# EAGLE design bbbcape (EAGLE 7.7.0)
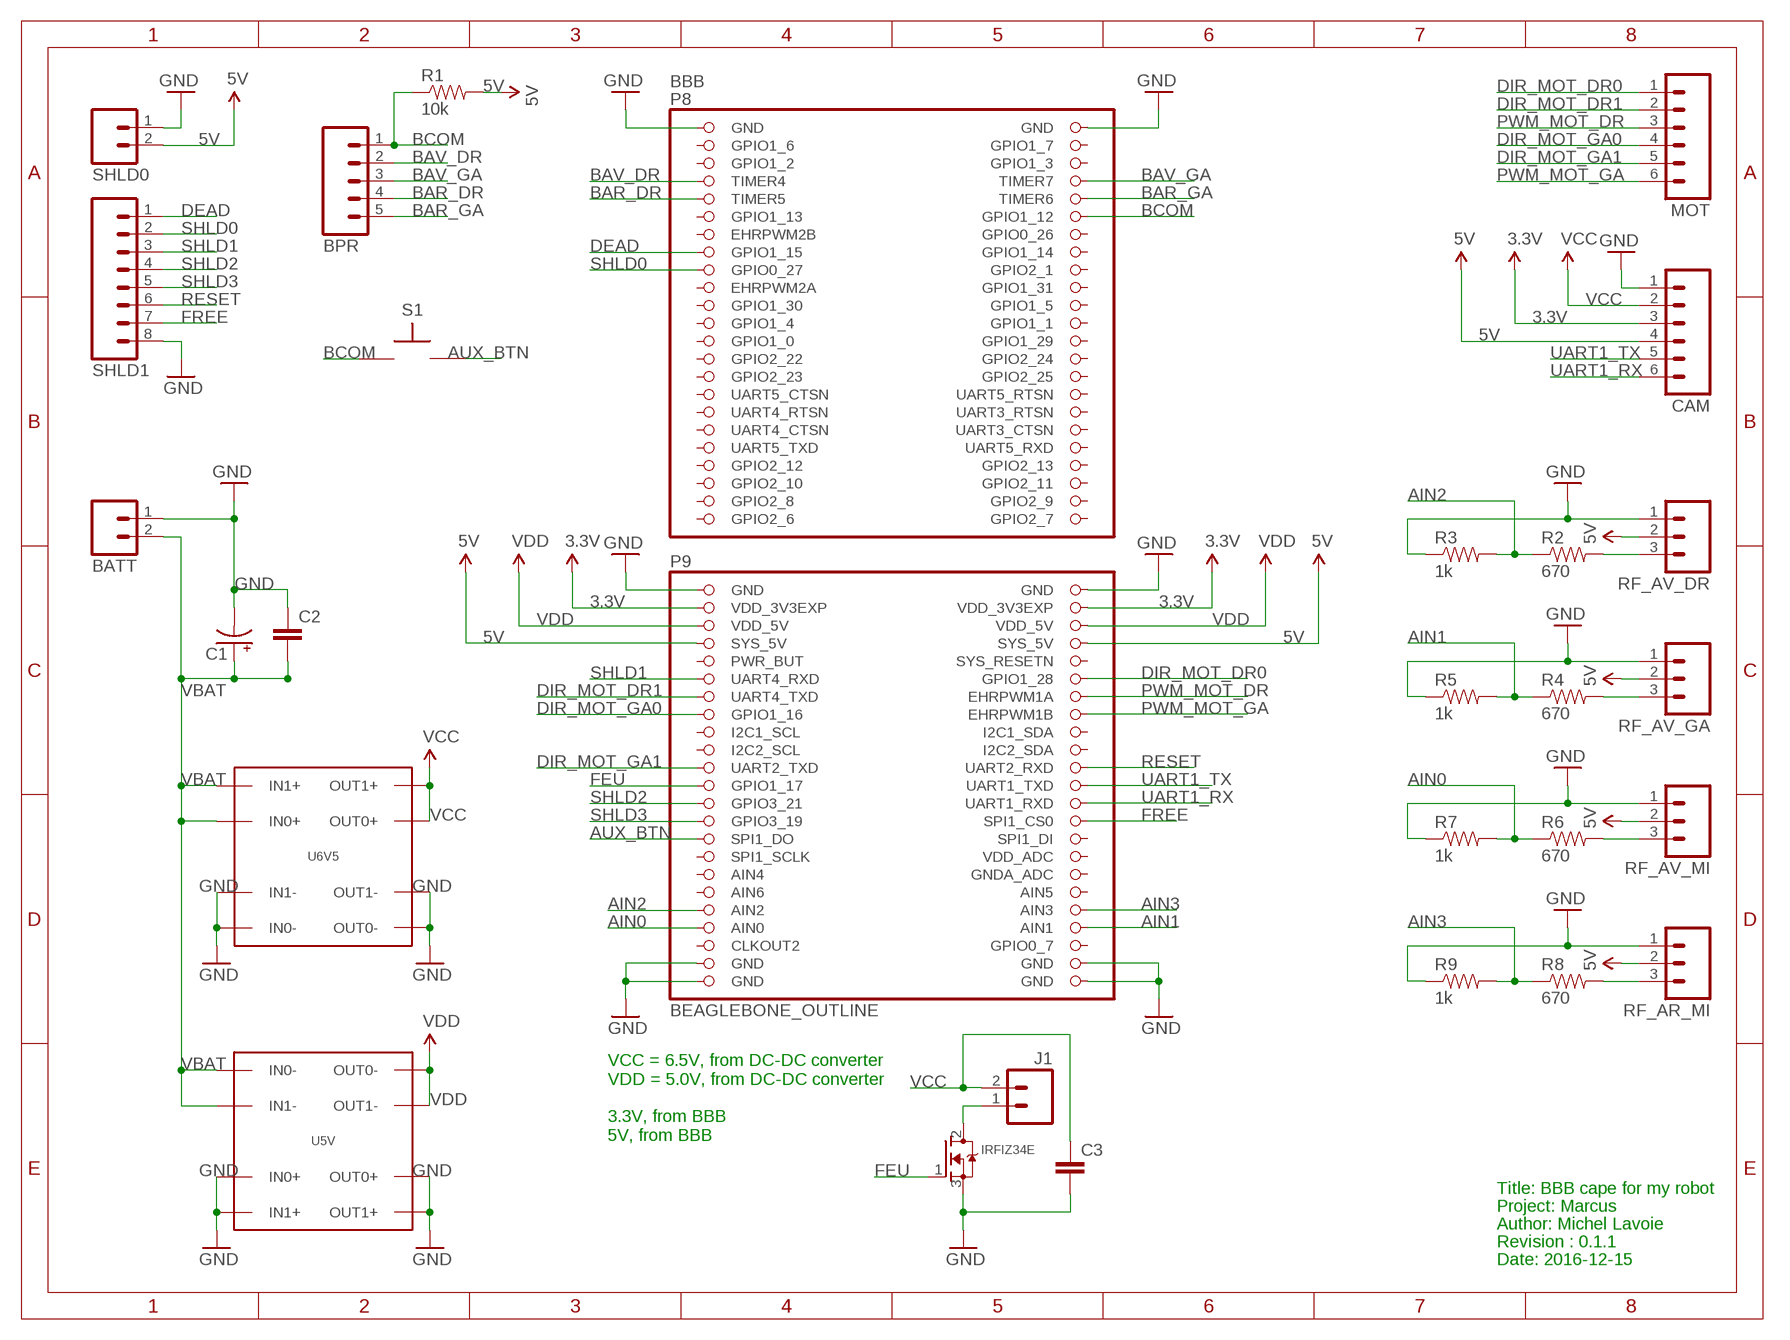
[diagram p0: schematic, sheet 1]

## Parts
BATT  M02PTH  [1X02]
BBB  BEAGLEBONE_OUTLINE  [BEAGLEBONE_SHIELD]
BPR  M05PTH  [1X05]
C1  100UF-25V-20%(PTH)  [CPOL-RADIAL-100UF-25V]
C2  0.1UF-50V-20%(PTH)KIT-EZ  [CAP-PTH-SMALL-KIT]
C3  0.1UF-50V-20%(PTH)KIT-EZ  [CAP-PTH-SMALL-KIT]
CAM  M06SILK_FEMALE_PTH  [1X06]
IRFIZ34E  MOSFET-NGDS_TO220V  [TO220V]
J1  M02PTH  [1X02]
MOT  M06SILK_FEMALE_PTH  [1X06]
R1  10k  RESISTORAXIAL-0.3  [AXIAL-0.3]
R2  670  RESISTORAXIAL-0.3  [AXIAL-0.3]
R3  1k  RESISTORAXIAL-0.3  [AXIAL-0.3]
R4  670  RESISTORAXIAL-0.3  [AXIAL-0.3]
R5  1k  RESISTORAXIAL-0.3  [AXIAL-0.3]
R6  670  RESISTORAXIAL-0.3  [AXIAL-0.3]
R7  1k  RESISTORAXIAL-0.3  [AXIAL-0.3]
R8  670  RESISTORAXIAL-0.3  [AXIAL-0.3]
R9  1k  RESISTORAXIAL-0.3  [AXIAL-0.3]
RF_AR_MI  M03PTH  [1X03]
RF_AV_DR  M03PTH  [1X03]
RF_AV_GA  M03PTH  [1X03]
RF_AV_MI  M03PTH  [1X03]
S1  TACTILE-SPST-6MM-SLIM  [6MM-SLIM]
SHLD0  M02PTH  [1X02]
SHLD1  M08  [1X08_ROUND]
U5V  SEEED-MP1584  [SEEED-MP1584]
U6V5  SEEED-MP1584  [SEEED-MP1584]

## Nets
3.3V: BBB.49(VDD_3V3EXP) BBB.50(VDD_3V3EXP) CAM.3
5V: BBB.53(SYS_5V) BBB.54(SYS_5V) CAM.4 R1.P$2 RF_AR_MI.2 RF_AV_DR.2 RF_AV_GA.2 RF_AV_MI.2 SHLD0.2
AIN0: BBB.85(AIN0) R6.P$1 R7.P$2
AIN1: BBB.86(AIN1) R4.P$1 R5.P$2
AIN2: BBB.83(AIN2) R2.P$1 R3.P$2
AIN3: BBB.84(AIN3) R8.P$1 R9.P$2
AUX_BTN: BBB.75(SPI1_DO) S1.P$2
BAR_DR: BBB.9(TIMER5) BPR.4
BAR_GA: BBB.10(TIMER6) BPR.5
BAV_DR: BBB.7(TIMER4) BPR.2
BAV_GA: BBB.8(TIMER7) BPR.3
BCOM: BBB.12(GPIO1_12) BPR.1 R1.P$1 S1.P$1
DEAD: BBB.15(GPIO1_15) SHLD1.1
DIR_MOT_DR0: BBB.58(GPIO1_28) MOT.1
DIR_MOT_DR1: BBB.59(UART4_TXD) MOT.2
DIR_MOT_GA0: BBB.61(GPIO1_16) MOT.4
DIR_MOT_GA1: BBB.67(UART2_TXD) MOT.5
FEU: BBB.69(GPIO1_17) IRFIZ34E.1(G)
FREE: BBB.74(SPI1_CS0) SHLD1.7
GND: BATT.1 BBB.1(GND) BBB.2(GND) BBB.47(GND) BBB.48(GND) BBB.89(GND) BBB.90(GND) BBB.91(GND) BBB.92(GND) C1.2(-) C2.1 C3.2 CAM.1 IRFIZ34E.3(S) R3.P$1 R5.P$1 R7.P$1 R9.P$1 RF_AR_MI.1 RF_AV_DR.1 RF_AV_GA.1 RF_AV_MI.1 SHLD0.1 SHLD1.8 U5V.IN0+ U5V.IN1+ U5V.OUT0+ U5V.OUT1+ U6V5.IN0- U6V5.IN1- U6V5.OUT0- U6V5.OUT1-
N$1: R2.P$2 RF_AV_DR.3
N$2: R4.P$2 RF_AV_GA.3
N$3: IRFIZ34E.2(D) J1.1
N$4: R6.P$2 RF_AV_MI.3
N$5: R8.P$2 RF_AR_MI.3
PWM_MOT_DR: BBB.60(EHRPWM1A) MOT.3
PWM_MOT_GA: BBB.62(EHRPWM1B) MOT.6
RESET: BBB.68(UART2_RXD) SHLD1.6
SHLD0: BBB.17(GPIO0_27) SHLD1.2
SHLD1: BBB.57(UART4_RXD) SHLD1.3
SHLD2: BBB.71(GPIO3_21) SHLD1.4
SHLD3: BBB.73(GPIO3_19) SHLD1.5
UART1_RX: BBB.72(UART1_RXD) CAM.6
UART1_TX: BBB.70(UART1_TXD) CAM.5
VBAT: BATT.2 C1.1(+) C2.2 U5V.IN0- U5V.IN1- U6V5.IN0+ U6V5.IN1+
VCC: C3.1 CAM.2 J1.2 U6V5.OUT0+ U6V5.OUT1+
VDD: BBB.51(VDD_5V) BBB.52(VDD_5V) U5V.OUT0- U5V.OUT1-
Unconnected: BBB.3(GPIO1_6) BBB.4(GPIO1_7) BBB.5(GPIO1_2) BBB.6(GPIO1_3) BBB.11(GPIO1_13) BBB.13(EHRPWM2B) BBB.14(GPIO0_26) BBB.16(GPIO1_14) BBB.18(GPIO2_1) BBB.19(EHRPWM2A) BBB.20(GPIO1_31) BBB.21(GPIO1_30) BBB.22(GPIO1_5) BBB.23(GPIO1_4) BBB.24(GPIO1_1) BBB.25(GPIO1_0) BBB.26(GPIO1_29) BBB.27(GPIO2_22) BBB.28(GPIO2_24) BBB.29(GPIO2_23) BBB.30(GPIO2_25) BBB.31(UART5_CTSN) BBB.32(UART5_RTSN) BBB.33(UART4_RTSN) BBB.34(UART3_RTSN) BBB.35(UART4_CTSN) BBB.36(UART3_CTSN) BBB.37(UART5_TXD) BBB.38(UART5_RXD) BBB.39(GPIO2_12) BBB.40(GPIO2_13) BBB.41(GPIO2_10) BBB.42(GPIO2_11) BBB.43(GPIO2_8) BBB.44(GPIO2_9) BBB.45(GPIO2_6) BBB.46(GPIO2_7) BBB.55(PWR_BUT) BBB.56(SYS_RESETN) BBB.63(I2C1_SCL) BBB.64(I2C1_SDA) BBB.65(I2C2_SCL) BBB.66(I2C2_SDA) BBB.76(SPI1_DI) BBB.77(SPI1_SCLK) BBB.78(VDD_ADC) BBB.79(AIN4) BBB.80(GNDA_ADC) BBB.81(AIN6) BBB.82(AIN5) BBB.87(CLKOUT2) BBB.88(GPIO0_7)

## Notes on the sheet
- VCC = 6.5V, from DC-DC converter
  VDD = 5.0V, from DC-DC converter
  
  3.3V, from BBB
  5V, from BBB
- Title: BBB cape for my robot
- Project: Marcus
- Author: Michel Lavoie
- Revision : 0.1.1
- Date: 2016-12-15

## Library data of the parts
BATT J1 SHLD0 = SparkFun-Connectors:M02: Standard 2-pin 0.1" header. Use with - straight break away headers ( PRT-00116) - right angle break away headers (PRT-00553) - swiss pins (PRT-00743) - machine pins (PRT-00117) - female headers (PRT-00115) Molex polarized connector foot print use with: PRT-08233 with associated crimp pins and housings. 2.54_SCREWTERM for use with PRT-10571. 3.5mm Screw Terminal footprints for PRT-08084 5mm Screw Terminal footprints for use with PRT-08432
BBB = adafruit:BEAGLEBONE_OUTLINE: Should match A3 pinout - but not completely tested
BPR = SparkFun-Connectors:M05: Header 5 Standard 5-pin 0.1" header. Use with straight break away headers (SKU : PRT-00116), right angle break away headers (PRT-00553), swiss pins (PRT-00743), machine pins (PRT-00117), and female headers (PRT-00115). Molex polarized connector foot print use with SKU : PRT-08230 with associated crimp pins and housings.
C1 = SparkFun-Capacitors:100UF-25V-20%(PTH): CAP-08439; PROD_ID: CAP-08439
C2 C3 = SparkFun-Capacitors:0.1UF-50V-20%(PTH): CAP-08370; PROD_ID: CAP-08370
CAM MOT = SparkFun-Connectors:M06: Header 6 Standard 6-pin 0.1" header. Use with straight break away headers (SKU : PRT-00116), right angle break away headers (PRT-00553), swiss pins (PRT-00743), machine pins (PRT-00117), and female headers (PRT-00115). Molex polarized connector foot print use with SKU : PRT-08094 with associated crimp pins and housings. NOTES ON THE VARIANTS LOCK and LOCK_LONGPADS... This footprint was designed to help hold the alignment of a through-hole component (i.e. 6-pin header) while soldering it into place. You may notice that each hole has been shifted either up or down by 0.005 of an inch from it's more standard position (which is a perfectly straight line). This slight alteration caused the pins (the squares in the middle) to touch the edges of the holes. Because they are alternating, it causes a "brace" to hold the component in place. 0.005 has proven to be the perfect amount of "off-center" position when using our standard breakaway headers. Although looks a little odd when you look at the bare footprint, once you have a header in there, the alteration is very hard to notice. Also,if you push a header all the way into place, it is covered up entirely on the bottom side. This idea of altering the position of holes to aid alignment will be further integrated into the Sparkfun Library for other footprints. It can help hold any component with 3 or more connection pins.; PROD_ID: CONN-08437
IRFIZ34E = adafruit:MOSFET-N: N-Channel Mosfet 2N7002E - 60V 260mA SOT23 [Digikey: 2N7002ET1GOSTR-ND] - REEL BSH103 - 30V 850mA SOT23 [Digikey: 568-5013-1-ND]
R1-R9 = SparkFun-Passives:RESISTOR: Resistor Basic schematic elements and footprints for 0603, 1206, and PTH resistors.
RF_AR_MI RF_AV_DR RF_AV_GA RF_AV_MI = SparkFun-Connectors:M03: Header 3 Standard 3-pin 0.1" header. Use with straight break away headers (SKU : PRT-00116), right angle break away headers (PRT-00553), swiss pins (PRT-00743), machine pins (PRT-00117), and female headers (PRT-00115). Molex polarized connector foot print use with SKU : PRT-08232 with associated crimp pins and housings.
S1 = michel:TACTILE-SPST-6MM-SLIM: Tactile Switch Buttons (6mm slim) https://www.adafruit.com/product/1489
SHLD1 = SparkFun-Connectors:M08: Header 8 Standard 8-pin 0.1" header. Use with straight break away headers (SKU : PRT-00116), right angle break away headers (PRT-00553), swiss pins (PRT-00743), machine pins (PRT-00117), and female headers (PRT-00115).; PROD_ID: CONN-08437
U5V U6V5 = michel:SEEED-MP1584: Adjustable Step-Down DC&DC Converter (0.8V - 18V&3A) SKU 106990005 https://www.seeedstudio.com/Adjustable-Step-Down-DC%26amp%3BDC-Converter-(0.8V-18V%26amp%3B3A)-p-1716.html#

## Board
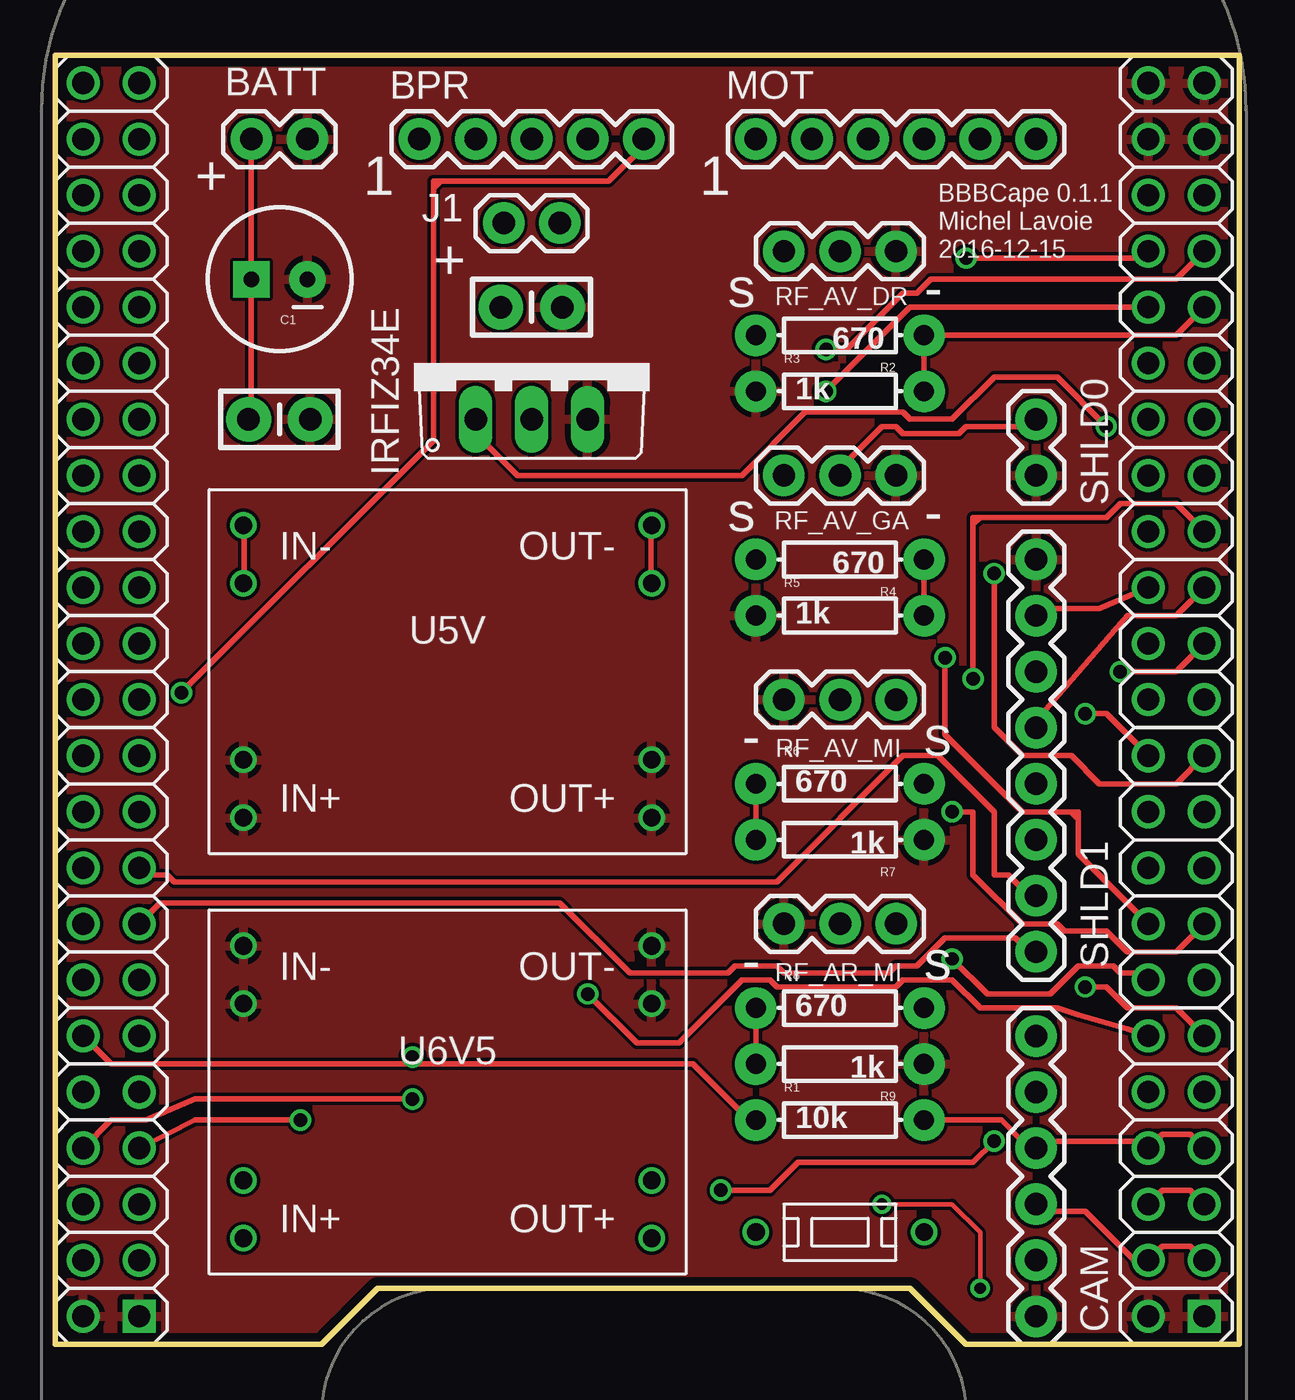
[diagram p1: board, top side]
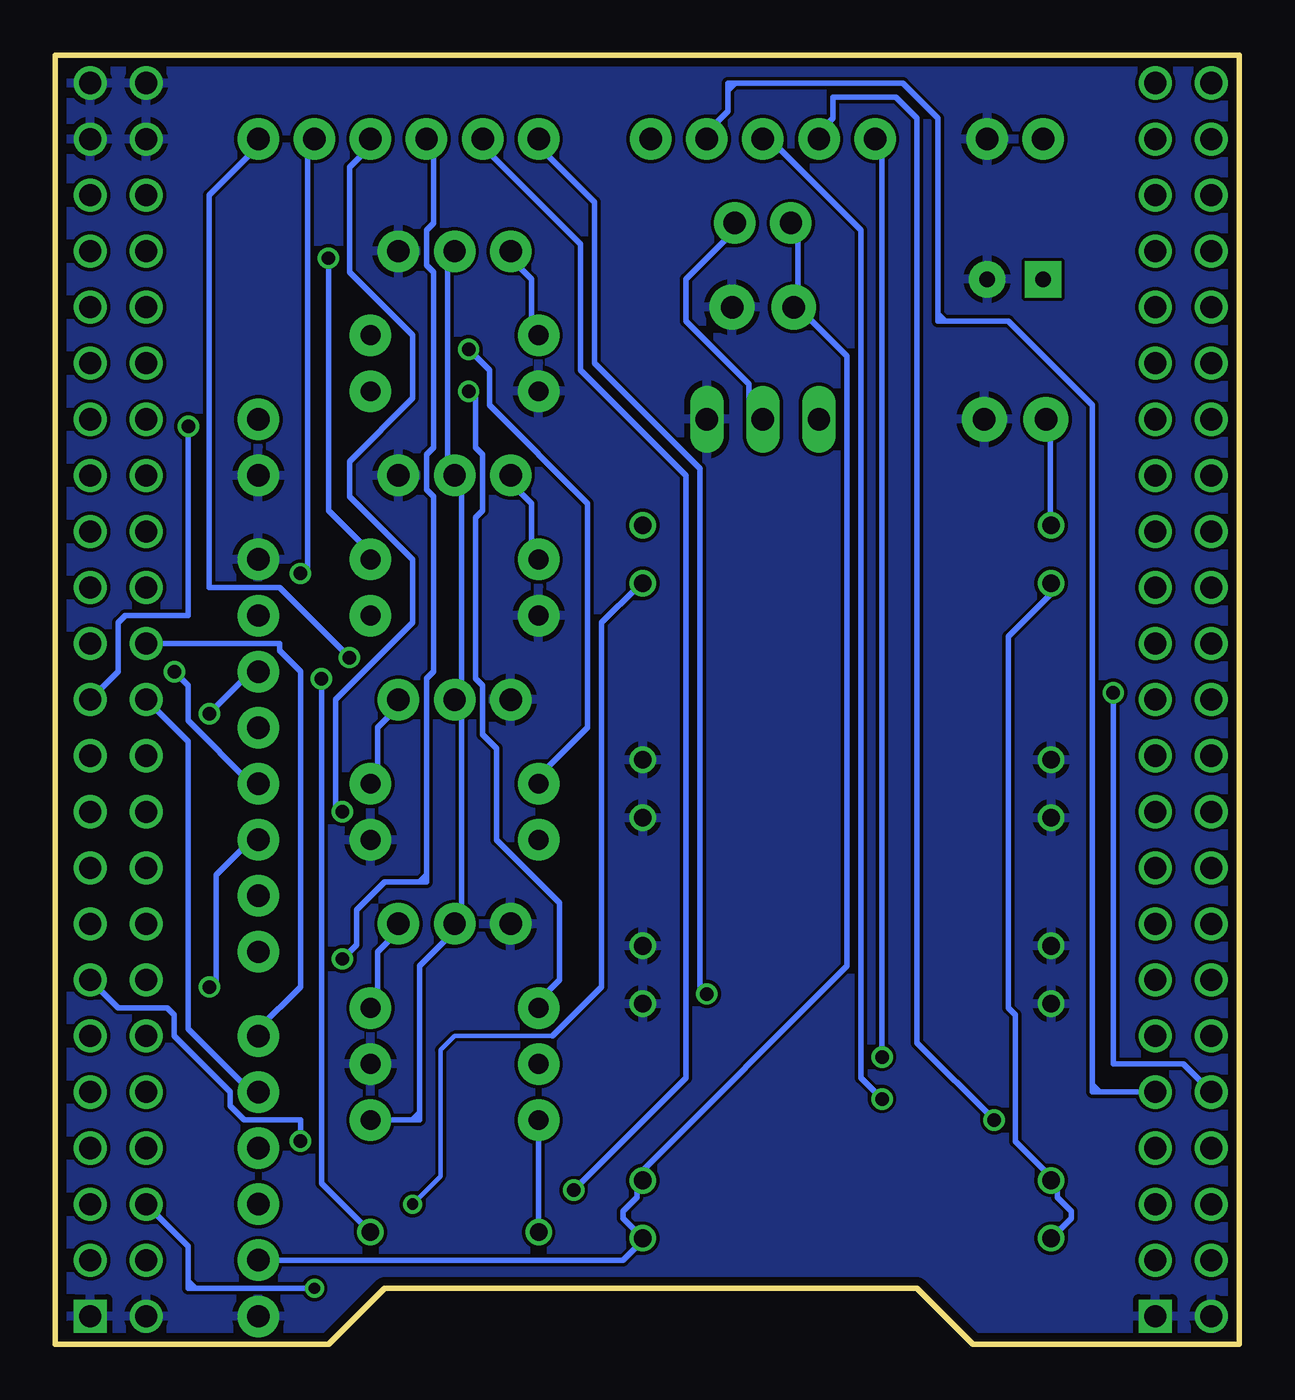
[diagram p2: board, bottom side, seen from below]

Size 53.66 x 58.41 mm. Coordinates in mm from the lower left corner, seen from the top.
Outline: 53.65,0 53.65,58.41 0,58.41 0,0 12.06,0 14.61,2.54 38.73,2.54 41.27,0 53.66,0
Copper layers (1*16): Top 0.0356mm / dielectric 1.5011mm / Bottom 0.0356mm
Design rules "oshpark-2layer": minimum track width 6mil, minimum drill 13mil, track to track 6mil, track to pad 6mil, pad to pad 6mil, via to via 6mil, smd to smd 6mil, copper to edge 15mil, drill to drill 6mil, minimum pad ring 7mil, minimum via ring 7mil, stop-mask expansion 2.5mil, vias tented up to drill 0mil, thermal gap 10mil

### Footprints (pad centres in the part's own frame; a part is rotated, then mirrored left to right if it is on the bottom)
1X02 = drill 1.016 pad 1.88: 1 0,0; 2 2.54,0
BEAGLEBONE_SHIELD = drill 1 square: 1 4.445,19.05; 47 52.705,19.05 | drill 1: 2 1.905,19.05; 3 4.445,21.59; 4 1.905,21.59; 5 4.445,24.13; 6 1.905,24.13; 7 4.445,26.67; 8 1.905,26.67; 9 4.445,29.21; 10 1.905,29.21; 11 4.445,31.75; 12 1.905,31.75; 13 4.445,34.29; 14 1.905,34.29; 15 4.445,36.83; 16 1.905,36.83; 17 4.445,39.37; 18 1.905,39.37; 19 4.445,41.91; 20 1.905,41.91; 21 4.445,44.45; 22 1.905,44.45; 23 4.445,46.99; 24 1.905,46.99; 25 4.445,49.53; 26 1.905,49.53; 27 4.445,52.07; 28 1.905,52.07; 29 4.445,54.61; 30 1.905,54.61; 31 4.445,57.15; 32 1.905,57.15; 33 4.445,59.69; 34 1.905,59.69; 35 4.445,62.23; 36 1.905,62.23; 37 4.445,64.77; 38 1.905,64.77; 39 4.445,67.31; 40 1.905,67.31; 41 4.445,69.85; 42 1.905,69.85; 43 4.445,72.39; 44 1.905,72.39; 45 4.445,74.93; 46 1.905,74.93; 48 50.165,19.05; 49 52.705,21.59; 50 50.165,21.59; 51 52.705,24.13; 52 50.165,24.13; 53 52.705,26.67; 54 50.165,26.67; 55 52.705,29.21; 56 50.165,29.21; 57 52.705,31.75; 58 50.165,31.75; 59 52.705,34.29; 60 50.165,34.29; 61 52.705,36.83; 62 50.165,36.83; 63 52.705,39.37; 64 50.165,39.37; 65 52.705,41.91; 66 50.165,41.91; 67 52.705,44.45; 68 50.165,44.45; 69 52.705,46.99; 70 50.165,46.99; 71 52.705,49.53; 72 50.165,49.53; 73 52.705,52.07; 74 50.165,52.07; 75 52.705,54.61; 76 50.165,54.61; 77 52.705,57.15; 78 50.165,57.15; 79 52.705,59.69; 80 50.165,59.69; 81 52.705,62.23; 82 50.165,62.23; 83 52.705,64.77; 84 50.165,64.77; 85 52.705,67.31; 86 50.165,67.31; 87 52.705,69.85; 88 50.165,69.85; 89 52.705,72.39; 90 50.165,72.39; 91 52.705,74.93; 92 50.165,74.93
1X05 = drill 1.016 pad 1.88: 1 0,0; 2 2.54,0; 3 5.08,0; 4 7.62,0; 5 10.16,0
CPOL-RADIAL-100UF-25V = drill 0.7 pad 1.651 square: 1 1.27,0 | drill 0.7 pad 1.651: 2 -1.27,0
CAP-PTH-SMALL-KIT = drill 1.016 pad 2.032: 1 -1.397,0; 2 1.397,0
1X06 = drill 1.016 pad 1.88: 1 0,0; 2 2.54,0; 3 5.08,0; 4 7.62,0; 5 10.16,0; 6 12.7,0
TO220V = drill 1.016 long: 1 -2.54,-2.54; 2 0,-2.54; 3 2.54,-2.54
AXIAL-0.3 = drill 0.9 pad 1.88: P$1 -3.81,0; P$2 3.81,0
1X03 = drill 1.016 pad 1.88: 1 0,0; 2 2.54,0; 3 5.08,0
6MM-SLIM = drill 0.8: P$1 -3.81,0; P$2 3.81,0
1X08_ROUND = drill 1.016 pad 1.88: 1 0,0; 2 2.54,0; 3 5.08,0; 4 7.62,0; 5 10.16,0; 6 12.7,0; 7 15.24,0; 8 17.78,0
SEEED-MP1584 = drill 0.8: IN0+ -9.25,-4; IN0- -9.25,6.625; IN1+ -9.25,-6.625; IN1- -9.25,4; OUT0+ 9.25,-4; OUT0- 9.25,6.625; OUT1+ 9.25,-6.625; OUT1- 9.25,4

### Placement (x,y rotation side)
BATT  11.43,54.61 180 top
BBB  -0.64,-17.78 0 top
BPR  16.51,54.61 0 top
C1  10.16,48.26 180 top
C2  10.16,41.91 180 top
C3  21.59,46.99 0 top
CAM  44.45,1.27 90 top
IRFIZ34E  21.59,44.45 0 top
J1  22.86,50.8 180 top
MOT  31.75,54.61 0 top
R1  35.56,10.16 0 top
R2  35.56,45.72 180 top
R3  35.56,43.18 0 top
R4  35.56,35.56 180 top
R5  35.56,33.02 0 top
R6  35.56,25.4 0 top
R7  35.56,22.86 180 top
R8  35.56,15.24 0 top
R9  35.56,12.7 180 top
RF_AR_MI  33.02,19.05 0 top
RF_AV_DR  38.1,49.53 180 top
RF_AV_GA  38.1,39.37 180 top
RF_AV_MI  33.02,29.21 0 top
S1  35.56,5.08 0 top
SHLD0  44.45,39.37 90 top
SHLD1  44.45,17.78 90 top
U5V  17.78,30.48 0 top
U6V5  17.78,11.43 0 top

### Tracks (layer width: path | path; a pad name or v marks a point on that pad's centre or on a via)
3.3V
  Top 0.254: BBB.49 51.44,4.45 50.16,4.45 BBB.50 48.9,3.81 46.67,6.03 44.77,6.03 CAM.3
5V
  Top 0.254: BBB.53 51.44,9.53 50.16,9.53 BBB.54 49.21,9.21 43.81,9.21 | R1.P$2 42.86,10.16 43.81,9.21 | 43.81,9.21 44.13,8.89 CAM.4 43.81,9.21 | SHLD0.2 44.13,41.59 41.27,41.59 40.96,41.27 38.42,41.27 38.1,41.59 37.47,41.59 35.56,39.69 RF_AV_GA.2
  Bottom 0.254: 35.24,28.89 35.24,19.37 RF_AR_MI.2 35.56,18.73 37.15,17.14 37.15,10.48 | 35.24,28.89 35.24,39.05 RF_AV_GA.2 35.88,39.69 35.88,49.21 RF_AV_DR.2 | 35.24,28.89 RF_AV_MI.2 | 37.47,10.16 37.15,10.16 37.15,10.48 | 37.47,10.16 R1.P$2 | 37.15,10.48 37.47,10.16
AIN0  (via drill 0.61)
  Top 0.254: BBB.85 50.8,48.26 39.69,48.26 39.05,47.62 38.42,47.62 35.88,45.09 v34.92,45.09 | R6.P$1 R7.P$2
  Bottom 0.254: v34.92,45.09 33.97,44.13 33.97,42.55 29.53,38.1 29.53,27.94 31.75,25.72 R6.P$1
AIN1  (via drill 0.61)
  Top 0.254: BBB.86 49.21,49.21 v41.27,49.21 | R4.P$1 R5.P$2
  Bottom 0.254: v41.27,49.21 41.27,37.78 39.37,35.88 R4.P$1
AIN2
  Top 0.254: BBB.83 50.8,45.72 R2.P$1 R3.P$2
AIN3  (via drill 0.61)
  Top 0.254: BBB.84 38.73,46.99 v34.92,43.18 | R8.P$1 R9.P$2
  Bottom 0.254: v34.92,43.18 34.61,42.86 34.61,40.64 34.29,40.32 34.29,37.78 34.61,37.47 34.61,30.16 34.29,29.84 34.29,27.62 33.66,26.99 33.66,22.86 30.8,20 30.8,16.51 31.75,15.56 R8.P$1
AUX_BTN  (via drill 0.61)
  Top 0.254: 41.59,37.15 41.59,37.47 41.91,37.47 | 41.59,37.15 v41.59,30.16 | 41.91,37.47 47.62,37.47 48.26,38.1 50.8,38.1 BBB.75 | 41.91,37.47 41.59,37.15
  Bottom 0.254: S1.P$2 41.59,7.3 v41.59,30.16
BAR_DR
  Bottom 0.254: 6.35,11.43 6.67,11.43 6.67,11.75 | 6.35,11.43 BBB.9 | 6.67,11.75 6.67,42.55 10.48,46.35 13.34,46.35 | 13.34,46.35 13.65,46.35 13.65,46.67 | 13.65,46.67 13.65,55.56 15.24,57.15 22.86,57.15 | 22.86,57.15 23.18,57.15 23.18,56.83 | 23.18,56.83 23.18,55.88 24.13,54.93 BPR.4 | 22.86,57.15 23.18,56.83 | 13.34,46.35 13.65,46.67 | 6.35,11.43 6.67,11.75
BAR_GA  (via drill 0.61)
  Top 0.254: v5.71,29.53 17.14,40.96 17.14,52.39 | 17.14,52.39 17.14,52.7 17.46,52.7 | 17.46,52.7 25.08,52.7 26.67,54.29 BPR.5 | 17.14,52.39 17.46,52.7
  Bottom 0.254: BBB.10 2.54,12.7 5.71,12.7 v5.71,29.53
BAV_DR  (via drill 0.61)
  Top 0.254: BBB.7 6.35,10.16 v11.11,10.16
  Bottom 0.254: v11.11,10.16 14.61,13.65 14.61,55.56 15.56,56.52 18.41,56.52 18.41,55.56 19.05,54.93 BPR.2
BAV_GA  (via drill 0.61)
  Top 0.254: BBB.8 2.54,10.16 4.13,10.16 6.35,11.11 v16.19,11.11
  Bottom 0.254: v16.19,11.11 17.14,12.06 17.14,50.48 21.27,54.61 BPR.3
BCOM  (via drill 0.61)
  Top 0.254: BBB.12 2.54,12.7 16.19,12.7 | 16.19,12.7 28.89,12.7 31.43,10.16 R1.P$1 | 16.19,12.7 v16.19,13.02
  Bottom 0.254: R1.P$1 S1.P$1 | BPR.1 16.19,54.29 v16.19,13.02
DEAD
  Top 0.254: BBB.15 4.76,20 22.86,20 26.04,16.83 30.48,16.83 30.8,17.14 32.7,17.14 33.02,16.83 37.78,16.83 38.1,17.14 39.05,17.14 40.32,18.41 43.5,18.41 44.13,17.78 SHLD1.1
DIR_MOT_DR0  (via drill 0.61)
  Top 0.254: BBB.58 48.58,14.29 46.35,14.92 45.4,15.24 41.91,15.24 40.64,16.51 38.42,16.51 38.1,16.19 32.7,16.19 32.38,16.51 31.11,16.51 28.26,13.65 26.35,13.65 v24.13,15.88
  Bottom 0.254: v24.13,15.88 24.45,16.19 24.45,39.69 29.21,44.45 29.21,51.75 31.75,54.29 MOT.1
DIR_MOT_DR1  (via drill 0.61)
  Top 0.254: v42.55,9.21 41.59,8.26 33.66,8.26 32.38,6.99 v30.16,6.99
  Bottom 0.254: BBB.59 50.8,15.24 48.58,15.24 48.26,14.92 48.26,13.97 45.72,11.43 45.72,10.79 45.09,10.16 42.55,10.16 v42.55,9.21 | MOT.2 34.29,54.29 29.84,49.85 29.84,44.13 25.08,39.37 25.08,12.06 v30.16,6.99
DIR_MOT_GA0  (via drill 0.61)
  Top 0.254: BBB.61 50.8,17.78 48.58,17.78 47.62,18.73 45.72,18.73 45.4,19.05 43.81,19.05 41.59,21.27 41.59,24.13 v40.64,24.13
  Bottom 0.254: v40.64,24.13 40.96,24.45 40.96,29.21 37.47,32.7 37.47,35.56 40.32,38.42 40.32,40.01 37.47,42.86 37.47,45.72 40.32,48.58 40.32,53.34 39.37,54.29 MOT.4
DIR_MOT_GA1  (via drill 0.61)
  Top 0.254: BBB.67 50.8,25.4 47.31,25.4 46.04,26.67 43.81,26.67 42.55,27.94 v42.55,34.92
  Bottom 0.254: v42.55,34.92 42.23,35.24 42.23,54.29 MOT.5
FEU  (via drill 0.61)
  Top 0.254: v47.62,41.59 45.4,43.81 42.55,43.81 40.64,41.91 38.73,41.91 38.42,42.23 33.97,42.23 31.11,39.37 20.95,39.37 19.05,41.27 IRFIZ34E.1
  Bottom 0.254: BBB.69 50.8,30.48 50.8,32.7 50.48,33.02 47.62,33.02 v47.62,41.59
FREE
  Top 0.254: BBB.74 47.31,33.34 44.77,33.34 SHLD1.7
GND
  pour Top: 0,58.42 53.34,58.42 53.34,0 0,0
  pour Bottom: 0,0 0,58.42 53.34,58.42 53.34,0
N$1
  Bottom 0.254: R2.P$2 32.07,46.04 32.07,48.26 33.02,49.21 RF_AV_DR.3
N$2
  Bottom 0.254: R4.P$2 32.07,35.88 32.07,38.1 33.02,39.05 RF_AV_GA.3
N$3
  Bottom 0.254: IRFIZ34E.2 22.23,42.55 22.23,43.5 25.08,46.35 25.08,48.26 22.86,50.48 J1.1
N$4
  Bottom 0.254: R6.P$2 39.05,25.72 39.05,27.94 38.1,28.89 RF_AV_MI.3
N$5
  Bottom 0.254: R8.P$2 39.05,15.56 39.05,17.78 38.1,18.73 RF_AR_MI.3
PWM_MOT_DR  (via drill 0.61)
  Top 0.254: BBB.60 49.21,16.83 48.26,16.83 47.94,17.14 46.35,17.14 45.09,15.88 42.23,15.88 v40.64,17.46
  Bottom 0.254: v40.64,17.46 40.01,18.1 40.01,19.68 38.73,20.95 37.15,20.95 | 37.15,20.95 36.83,20.95 36.83,21.27 | 36.83,21.27 36.83,30.16 36.51,30.48 36.51,38.42 36.83,38.73 36.83,40.32 36.51,40.64 36.51,48.58 36.83,48.9 36.83,50.48 36.51,50.8 36.51,54.29 MOT.3 | 36.83,21.27 37.15,20.95
PWM_MOT_GA  (via drill 0.61)
  Top 0.254: BBB.62 46.35,22.23 46.35,23.81 | 46.35,23.81 46.35,24.13 46.04,24.13 | 46.04,24.13 43.81,24.13 40.32,27.62 v40.32,31.11 | 46.04,24.13 46.35,23.81
  Bottom 0.254: v40.32,31.11 43.5,34.29 46.67,34.29 46.67,52.07 44.45,54.29 MOT.6
RESET  (via drill 0.61)
  Top 0.254: BBB.68 47.62,28.57 v46.67,28.57
  Bottom 0.254: v46.67,28.57 44.77,30.48 SHLD1.6
SHLD0
  Top 0.254: BBB.17 4.13,21.27 5.08,21.27 5.4,20.95 32.7,20.95 38.42,26.67 40.01,26.67 42.55,24.13 42.55,21.27 43.18,21.27 44.13,20.32 SHLD1.2
SHLD1  (via drill 0.61)
  Top 0.254: BBB.57 50.8,15.24 48.58,15.24 47.62,16.19 v46.67,16.19
  Bottom 0.254: v46.67,16.19 46.35,16.51 46.35,21.27 44.77,22.86 SHLD1.3
SHLD2  (via drill 0.61)
  Top 0.254: BBB.71 50.8,30.48 v48.26,30.48
  Bottom 0.254: v48.26,30.48 47.62,29.84 47.62,28.26 44.77,25.4 SHLD1.4
SHLD3
  Top 0.254: BBB.73 50.8,33.02 48.58,33.02 44.45,28.26 SHLD1.5
UART1_RX
  Bottom 0.254: BBB.72 43.5,31.75 43.5,31.43 42.55,30.48 42.55,16.19 44.45,14.29 CAM.6
UART1_TX
  Bottom 0.254: BBB.70 47.62,27.3 47.62,14.29 44.77,11.43 CAM.5
VBAT
  Top 0.254: C2.2 8.89,41.91 C1.1 BATT.2 | U5V.IN1- 8.57,34.61 8.57,36.83 U5V.IN0-
  Bottom 0.254: U6V5.IN1+ 7.62,5.71 7.62,6.03 8.26,6.67 8.26,7.3 U6V5.IN0+ 8.57,7.62 10.16,9.21 10.16,14.92 10.48,15.24 10.48,32.07 8.57,33.97 8.57,34.29 U5V.IN1- | C2.2 8.57,41.91 8.57,37.15 U5V.IN0-
VCC
  Bottom 0.254: J1.2 20,50.48 20,46.99 | CAM.2 27.94,3.81 26.99,4.76 U6V5.OUT1+ 27.94,5.71 27.94,6.03 27.3,6.67 27.3,7.3 U6V5.OUT0+ 26.99,7.62 26.99,7.94 17.78,17.14 17.78,44.77 20,46.99 | 20,46.99 C3.1
VDD  (via drill 0.51)
  Top 0.203: v37.47,6.35 40.64,6.35 41.91,5.08 v41.91,2.54
  Top 0.254: U5V.OUT1- 26.99,34.61 26.99,36.83 U5V.OUT0- | BBB.52 50.16,6.99 51.44,6.99 BBB.51
  Bottom 0.203: 31.11,13.97 35.56,13.97 36.2,13.34 36.2,7.62 v37.47,6.35
  Bottom 0.254: 31.11,13.97 28.89,16.19 28.89,32.7 27.3,34.29 U5V.OUT1- | 47.31,2.54 47.62,2.54 47.62,2.86 | 47.31,2.54 v41.91,2.54 | 47.62,2.86 47.62,4.45 BBB.52 | 47.31,2.54 47.62,2.86

### Text on the board
tPlace: + | 1 | 1 | BBBCape 0.1.1 | Michel Lavoie | 2016-12-15 | + | s | - | s | - | - | s | - | s